# Altium schematic sheet Main.SchDoc
size 127 x 127 mm
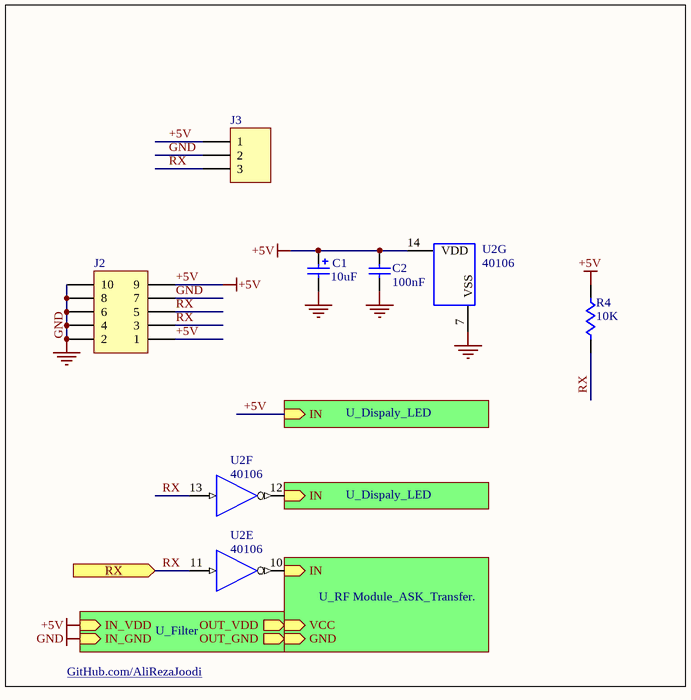
[diagram p0: Main.SchDoc]

## Parts
C1  10uF  [CAPPR2.5-6.3x5]
C2  100nF  [CAPNTO2.54-3.05x1.78A]
J2  Header 5X2  [FKV10SN]  (value not drawn)
J3  3PIN  [PIN3]  (value not drawn)
R4  10K  [AXIAL-0.4]
U2  40106  [DIP14]  (parts E,F,G of 7)

## Sub-sheets
U_Dispaly_LED = Dispaly_LED.SchDoc: IN (in)
U_Dispaly_LED = Dispaly_LED.SchDoc: IN (in)
U_Filter = Filter.SchDoc: IN_VDD (in), IN_GND (in), OUT_VDD (out), OUT_GND (out)
U_RF Module_ASK_Transfer. = RF Module_ASK_Transfer.SchDoc: VCC (in), GND (in), IN (in)

## Ports
RX (in)

## Nets
+5V: C1.1 C2.2 J2.1 J2.9 J3.1 R4.1 U2.14(VDD) ; sheet U_Filter/IN_VDD, sheet U_Dispaly_LED/IN
GND: C1.2 C2.1 J2.2 J2.4 J2.6 J2.7 J2.8 J2.10 J3.2 U2.7(VSS) ; sheet U_Filter/IN_GND
RX: J2.3 J2.5 J3.3 R4.2 U2.11(I) U2.13(I) ; port RX
NetU2_10: U2.10(~{O}) ; sheet U_RF Module_ASK_Transfer./IN
NetU2_12: U2.12(~{O}) ; sheet U_Dispaly_LED/IN
(unnamed): sheet U_Filter/OUT_VDD, sheet U_RF Module_ASK_Transfer./VCC
(unnamed): sheet U_Filter/OUT_GND, sheet U_RF Module_ASK_Transfer./GND

## Notes on the sheet
- GitHub.com/AliRezaJoodi

## Library data of the parts
C1 = Cap Pol1: Polarized Capacitor (Radial); Manufacturer: Generic Components; Class I: Passive; Published: 8-Jun-2000; Revision: July-2002: Re-released for DXP Platform.; Publisher: Altium Limited; Class II: Capacitor
C2 = Cap: Capacitor; Manufacturer: Generic Components; Class I: Passive; Published: 8-Jun-2000; Revision: July-2002: Re-released for DXP Platform.; Publisher: Altium Limited; Class II: Capacitor
J2 = Header 5X2: Header, 5-Pin, Dual row; Manufacturer: Generic Components; Class I: Connector; Revision: July-2002: Re-released for DXP Platform.; Publisher: Altium Limited
J3 = Header 3H: Header, 3-Pin,  Right Angle; Manufacturer: Generic Components; Class I: Connector; Revision: July-2002: Re-released for DXP Platform.; Publisher: Altium Limited
R4 = Res1: Resistor; Manufacturer: Generic Components; Class I: Passive; Published: 8-Jun-2000; Revision: July-2002: Re-released for DXP Platform.; Publisher: Altium Limited; Class II: Resistor
U2 = 40106: Hex inverting Schmitt trigger, 14-Pin; Publisher: Altium Limited; ComponentLink1URL: http://www.nxp.com